# EAGLE schematic flexo_wiring_rpi (EAGLE 9.2.2)
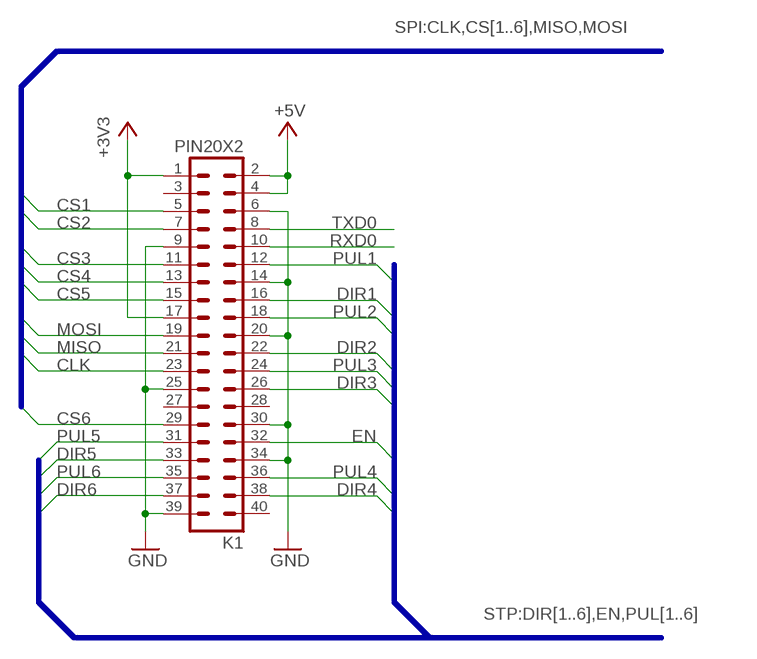
[diagram p0: schematic, sheet 1]

## Parts
K1  PIN20X2  [PIN_20X2]

## Nets
+3V3: K1.1 K1.17
+5V: K1.2 K1.4
CLK: K1.23
CS1: K1.5
CS2: K1.7
CS3: K1.11
CS4: K1.13
CS5: K1.15
CS6: K1.29
DIR1: K1.16
DIR2: K1.22
DIR3: K1.26
DIR4: K1.38
DIR5: K1.33
DIR6: K1.37
EN: K1.32
GND: K1.6 K1.9 K1.14 K1.20 K1.25 K1.30 K1.34 K1.39
MISO: K1.21
MOSI: K1.19
PUL1: K1.12
PUL2: K1.18
PUL3: K1.24
PUL4: K1.36
PUL5: K1.31
PUL6: K1.35
RXD0: K1.10
TXD0: K1.8
Unconnected: K1.3 K1.27 K1.28 K1.40

## Buses
SPI:CLK,CS[1..6],MISO,MOSI
STP:DIR[1..6],EN,PUL[1..6]

## Library data of the parts
K1 = FLYFISH:PIN20X2

## Net classes
0 default: width 0.406 mm, clearance 0.203 mm